# EAGLE design Adapter (EAGLE 9.6.2)
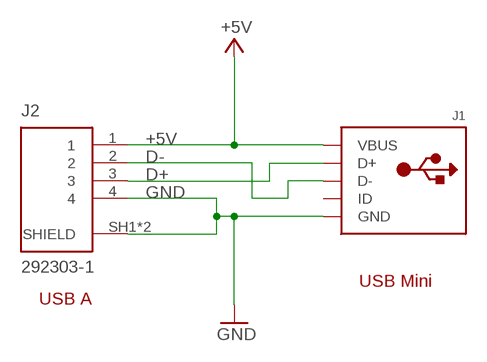
[diagram p0: schematic, sheet 1]

## Parts
J1  USBMINIB  [USB-MINIB]
J2  292303-1  [292303-1]

## Nets
+5V: J1.VBUS J2.1
D+: J1.D+ J2.3
D-: J1.D- J2.2
GND: J1.GND J2.4 J2.SH1(SHIELD) J2.SH2(SHIELD)
Unconnected: J1.ID

## Notes on the sheet
- USB Mini
- USB A

## Library data of the parts
J1 = adafruit:USB: USB Connectors USBMINIB - Surface Mount Female Mini-B USB Connector 4UConnector: 06564 By microbuilder.eu Thru-hole RA Female Mini-B USB Connector 4UConnector: 18732 By ladyada.net
J2 = USB connector:292303-1: CONN RCPT USB2.0 TYPEA 4POS R/A Manufacturer's datasheet <https://www.te.com/commerce/DocumentDelivery/DDEController?Action=srchrtrv&DocNm=292303&DocType=Customer+Drawing&DocLang=English>; CREATED_BY: PCBLayout.com; DIGIKEY_PARTNO: A31726-ND; MANUFACTURER: TE Connectivity AMP Connectors; MPN: 292303-1

## Board
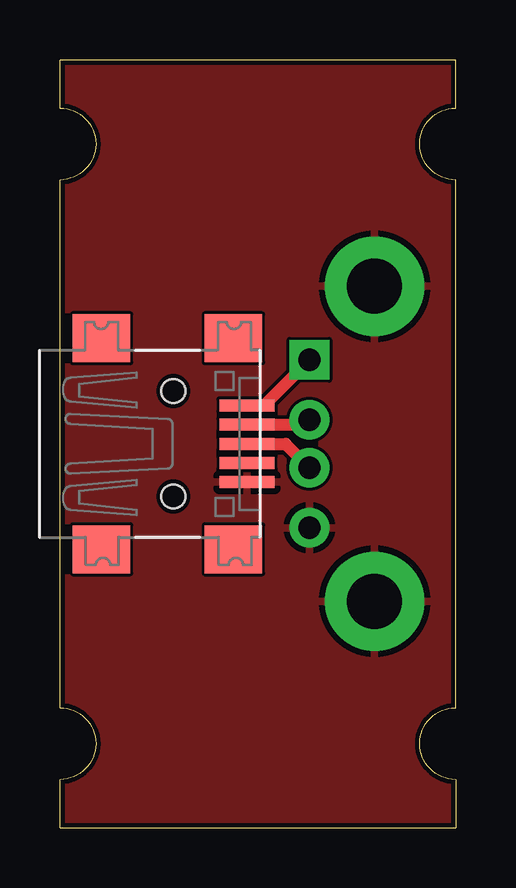
[diagram p1: board, top side]
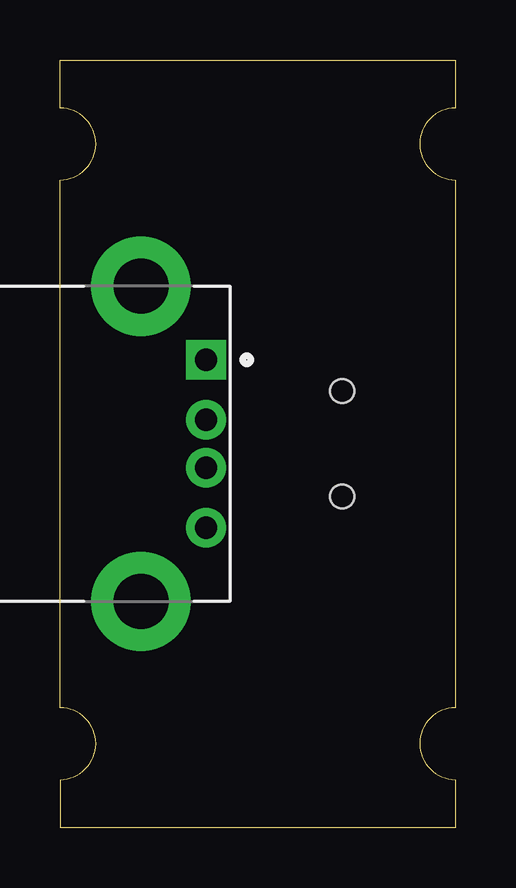
[diagram p2: board, bottom side, seen from below]

Size 16.5 x 32 mm. Coordinates in mm from the lower left corner, seen from the top.
Outline: 16.5,5 16.5,27 arc-180 16.5,30 16.5,32 0,32 0,30 arc-180 0,27 0,5 arc-180 0,2 0,0 16.5,0 16.5,2 arc-180 16.5,5
Copper layers (1*16): Top 0.035mm / dielectric 1.6mm / Bottom 0.035mm
Design rules "jlcpcb-2layers": minimum track width 5mil, minimum drill 0.3mm, track to track 5mil, track to pad 5mil, pad to pad 5mil, via to via 5mil, smd to smd 5mil, copper to edge 0.2mm, drill to drill 6mil, minimum pad ring 10mil, minimum via ring 3mil, stop-mask expansion 4mil, vias tented up to drill 0mil, thermal gap 10mil

### Footprints (pad centres in the part's own frame; a part is rotated, then mirrored left to right if it is on the bottom)
USB-MINIB = smd 0.5 x 2.308: D+ 0,4.064; D- -0.8,4.064; GND 1.6,4.064; ID 0.8,4.064; VBUS -1.6,4.064 | smd 2 x 2.4: GND1 -4.4,-2; GND2 -4.4,3.5; GND3 4.4,3.5; GND4 4.4,-2 | hole 1: -2.2,1; 2.2,1
292303-1 = drill 0.92 square: 1 -3.5,2.71 | drill 0.92: 2 -1,2.71; 3 1,2.71; 4 3.5,2.71 | drill 2.3: SH1 -6.57,0; SH2 6.57,0

### Placement (x,y rotation side)
J1  3.74,16 270 top
J2  13.12,16 270 bottom

### Tracks (layer width: path | path; a pad name or v marks a point on that pad's centre or on a via)
+5V
  Top 0.508: J1.VBUS 8.51,17.6 J2.1
D+
  Top 0.508: J1.D+ 9.41,16 J2.3
D-
  Top 0.508: J1.D- 10.21,16.8 J2.2
GND
  Top 0.508: J1.GND 8.51,14.4
  pour Top: -1.5,33 18.5,33 18.5,-1 -1.5,-1